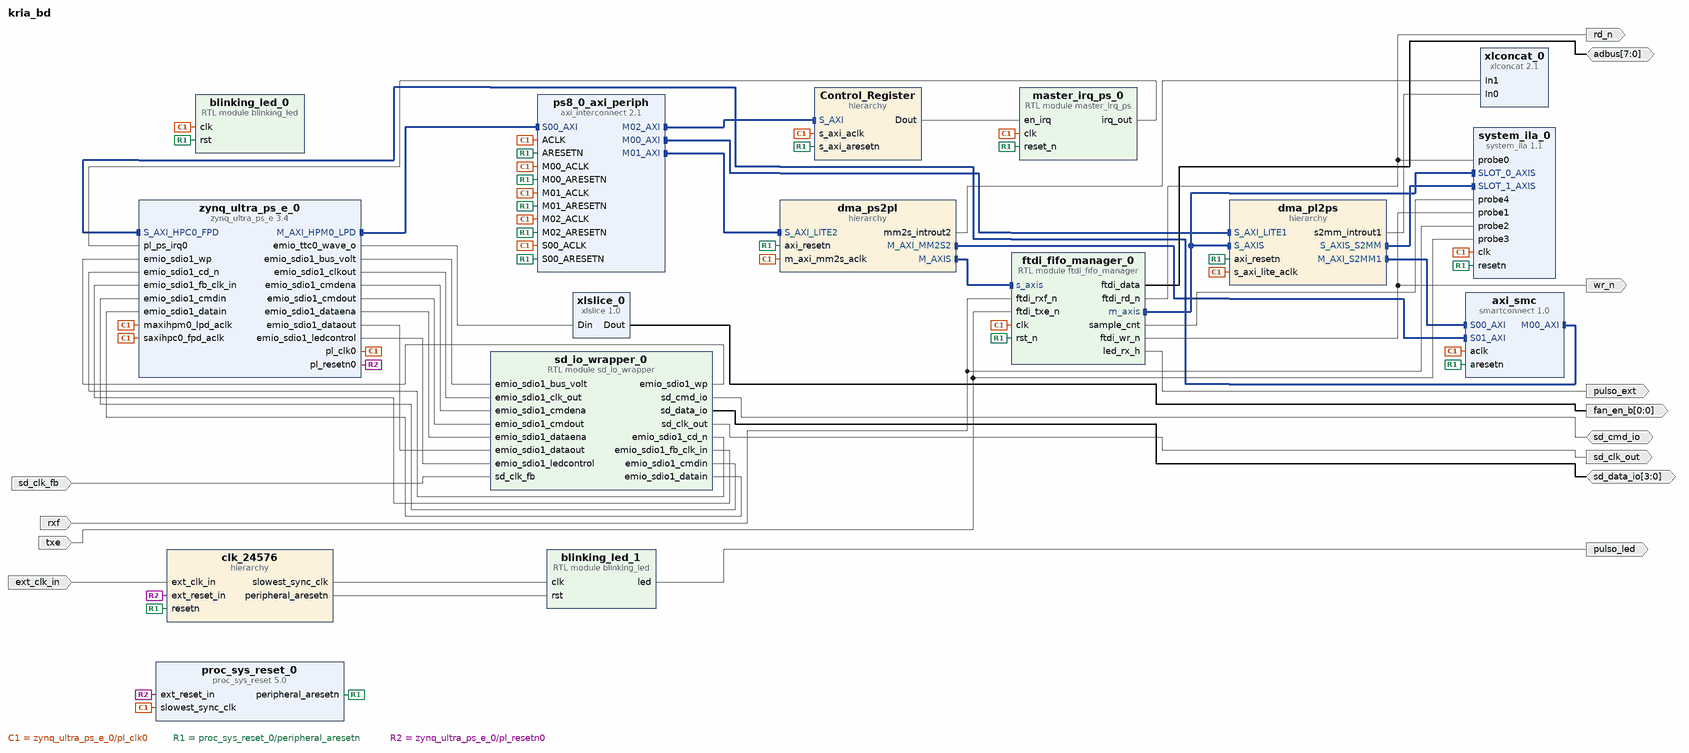
[diagram p0: block diagram of the top level]
# Vivado block design kria_bd, xck26-sfvc784-2LV-c, Vivado 2022.2
create_bd_design kria_bd

create_bd_port -dir O -from 0 -to 0 fan_en_b
create_bd_port -dir O pulso_led
create_bd_port -dir I -type clk ext_clk_in
set_property -dict {CONFIG.FREQ_HZ 24576000} [get_bd_ports ext_clk_in]
create_bd_port -dir O pulso_ext
create_bd_port -dir IO -from 7 -to 0 adbus
create_bd_port -dir O rd_n
create_bd_port -dir O wr_n
create_bd_port -dir I rxf
create_bd_port -dir I txe
create_bd_port -dir O sd_clk_out
create_bd_port -dir IO sd_cmd_io
create_bd_port -dir IO -from 3 -to 0 sd_data_io
create_bd_port -dir I sd_clk_fb

create_bd_cell -type ip -vlnv xilinx.com:ip:xlslice:1.0 xlslice_0
set_property -dict {CONFIG.DIN_FROM 2 CONFIG.DIN_TO 2 CONFIG.DIN_WIDTH 3} [get_bd_cells xlslice_0]
create_bd_cell -type ip -vlnv xilinx.com:ip:zynq_ultra_ps_e:3.4 zynq_ultra_ps_e_0
set_property -dict [list \
  CONFIG.PSU_BANK_0_IO_STANDARD LVCMOS18 \
  CONFIG.PSU_BANK_1_IO_STANDARD LVCMOS18 \
  CONFIG.PSU_BANK_2_IO_STANDARD LVCMOS18 \
  CONFIG.PSU_BANK_3_IO_STANDARD LVCMOS18 \
  CONFIG.PSU_USB3__DUAL_CLOCK_ENABLE 0 \
  CONFIG.PSU__CRF_APB__ACPU_CTRL__FREQMHZ 1333.333 \
  CONFIG.PSU__CRF_APB__ACPU_CTRL__SRCSEL APLL \
  CONFIG.PSU__CRF_APB__APLL_CTRL__SRCSEL PSS_REF_CLK \
  CONFIG.PSU__CRF_APB__APLL_FRAC_CFG__ENABLED 1 \
  CONFIG.PSU__CRF_APB__DBG_FPD_CTRL__FREQMHZ 250 \
  CONFIG.PSU__CRF_APB__DBG_FPD_CTRL__SRCSEL IOPLL \
  CONFIG.PSU__CRF_APB__DBG_TRACE_CTRL__FREQMHZ 250 \
  CONFIG.PSU__CRF_APB__DBG_TRACE_CTRL__SRCSEL IOPLL \
  CONFIG.PSU__CRF_APB__DBG_TSTMP_CTRL__FREQMHZ 250 \
  CONFIG.PSU__CRF_APB__DBG_TSTMP_CTRL__SRCSEL IOPLL \
  CONFIG.PSU__CRF_APB__DDR_CTRL__FREQMHZ 1200 \
  CONFIG.PSU__CRF_APB__DDR_CTRL__SRCSEL DPLL \
  CONFIG.PSU__CRF_APB__DPDMA_REF_CTRL__FREQMHZ 600 \
  CONFIG.PSU__CRF_APB__DPDMA_REF_CTRL__SRCSEL APLL \
  CONFIG.PSU__CRF_APB__DPLL_CTRL__SRCSEL PSS_REF_CLK \
  CONFIG.PSU__CRF_APB__DP_AUDIO_REF_CTRL__SRCSEL RPLL \
  CONFIG.PSU__CRF_APB__DP_STC_REF_CTRL__SRCSEL RPLL \
  CONFIG.PSU__CRF_APB__DP_VIDEO_REF_CTRL__SRCSEL VPLL \
  CONFIG.PSU__CRF_APB__GDMA_REF_CTRL__FREQMHZ 600 \
  CONFIG.PSU__CRF_APB__GDMA_REF_CTRL__SRCSEL DPLL \
  CONFIG.PSU__CRF_APB__GPU_REF_CTRL__FREQMHZ 600 \
  CONFIG.PSU__CRF_APB__GPU_REF_CTRL__SRCSEL IOPLL \
  CONFIG.PSU__CRF_APB__TOPSW_LSBUS_CTRL__FREQMHZ 100 \
  CONFIG.PSU__CRF_APB__TOPSW_LSBUS_CTRL__SRCSEL IOPLL \
  CONFIG.PSU__CRF_APB__TOPSW_MAIN_CTRL__FREQMHZ 533.33 \
  CONFIG.PSU__CRF_APB__TOPSW_MAIN_CTRL__SRCSEL DPLL \
  CONFIG.PSU__CRF_APB__VPLL_CTRL__SRCSEL PSS_REF_CLK \
  CONFIG.PSU__CRL_APB__ADMA_REF_CTRL__FREQMHZ 500 \
  CONFIG.PSU__CRL_APB__ADMA_REF_CTRL__SRCSEL IOPLL \
  CONFIG.PSU__CRL_APB__CPU_R5_CTRL__FREQMHZ 533.333 \
  CONFIG.PSU__CRL_APB__CPU_R5_CTRL__SRCSEL RPLL \
  CONFIG.PSU__CRL_APB__DBG_LPD_CTRL__FREQMHZ 250 \
  CONFIG.PSU__CRL_APB__DBG_LPD_CTRL__SRCSEL IOPLL \
  CONFIG.PSU__CRL_APB__IOPLL_CTRL__SRCSEL PSS_REF_CLK \
  CONFIG.PSU__CRL_APB__IOU_SWITCH_CTRL__FREQMHZ 250 \
  CONFIG.PSU__CRL_APB__IOU_SWITCH_CTRL__SRCSEL IOPLL \
  CONFIG.PSU__CRL_APB__LPD_LSBUS_CTRL__FREQMHZ 100 \
  CONFIG.PSU__CRL_APB__LPD_LSBUS_CTRL__SRCSEL IOPLL \
  CONFIG.PSU__CRL_APB__LPD_SWITCH_CTRL__FREQMHZ 500 \
  CONFIG.PSU__CRL_APB__LPD_SWITCH_CTRL__SRCSEL IOPLL \
  CONFIG.PSU__CRL_APB__PCAP_CTRL__FREQMHZ 200 \
  CONFIG.PSU__CRL_APB__PCAP_CTRL__SRCSEL IOPLL \
  CONFIG.PSU__CRL_APB__PL0_REF_CTRL__FREQMHZ 100 \
  CONFIG.PSU__CRL_APB__PL0_REF_CTRL__SRCSEL IOPLL \
  CONFIG.PSU__CRL_APB__QSPI_REF_CTRL__FREQMHZ 125 \
  CONFIG.PSU__CRL_APB__QSPI_REF_CTRL__SRCSEL IOPLL \
  CONFIG.PSU__CRL_APB__RPLL_CTRL__SRCSEL PSS_REF_CLK \
  CONFIG.PSU__CRL_APB__SDIO1_REF_CTRL__FREQMHZ 10 \
  CONFIG.PSU__CRL_APB__SDIO1_REF_CTRL__SRCSEL IOPLL \
  CONFIG.PSU__CRL_APB__SPI1_REF_CTRL__SRCSEL IOPLL \
  CONFIG.PSU__CRL_APB__TIMESTAMP_REF_CTRL__FREQMHZ 100 \
  CONFIG.PSU__CRL_APB__TIMESTAMP_REF_CTRL__SRCSEL IOPLL \
  CONFIG.PSU__CRL_APB__USB3__ENABLE 0 \
  CONFIG.PSU__CSUPMU__PERIPHERAL__VALID 1 \
  CONFIG.PSU__DDRC__BUS_WIDTH {64 Bit} \
  CONFIG.PSU__DDRC__COMPONENTS Components \
  CONFIG.PSU__DDRC__DEVICE_CAPACITY {8192 MBits} \
  CONFIG.PSU__DDRC__DRAM_WIDTH {16 Bits} \
  CONFIG.PSU__DDRC__ECC Disabled \
  CONFIG.PSU__DDRC__MEMORY_TYPE {DDR 4} \
  CONFIG.PSU__DDRC__SPEED_BIN DDR4_2400R \
  CONFIG.PSU__DDR_HIGH_ADDRESS_GUI_ENABLE 1 \
  CONFIG.PSU__DDR__INTERFACE__FREQMHZ 600.000 \
  CONFIG.PSU__DISPLAYPORT__PERIPHERAL__ENABLE 0 \
  CONFIG.PSU__DLL__ISUSED 1 \
  CONFIG.PSU__FPGA_PL0_ENABLE 1 \
  CONFIG.PSU__GPIO0_MIO__IO {MIO 0 .. 25} \
  CONFIG.PSU__GPIO0_MIO__PERIPHERAL__ENABLE 1 \
  CONFIG.PSU__GPIO1_MIO__IO {MIO 26 .. 51} \
  CONFIG.PSU__GPIO1_MIO__PERIPHERAL__ENABLE 1 \
  CONFIG.PSU__I2C1__PERIPHERAL__ENABLE 1 \
  CONFIG.PSU__I2C1__PERIPHERAL__IO {MIO 24 .. 25} \
  CONFIG.PSU__IOU_SLCR__IOU_TTC_APB_CLK__TTC0_SEL APB \
  CONFIG.PSU__IOU_SLCR__IOU_TTC_APB_CLK__TTC1_SEL APB \
  CONFIG.PSU__IOU_SLCR__IOU_TTC_APB_CLK__TTC2_SEL APB \
  CONFIG.PSU__IOU_SLCR__IOU_TTC_APB_CLK__TTC3_SEL APB \
  CONFIG.PSU__OVERRIDE__BASIC_CLOCK 0 \
  CONFIG.PSU__PMU_COHERENCY 0 \
  CONFIG.PSU__PMU__AIBACK__ENABLE 0 \
  CONFIG.PSU__PMU__EMIO_GPI__ENABLE 0 \
  CONFIG.PSU__PMU__EMIO_GPO__ENABLE 0 \
  CONFIG.PSU__PMU__GPI0__ENABLE 1 \
  CONFIG.PSU__PMU__GPI0__IO {MIO 26} \
  CONFIG.PSU__PMU__GPI1__ENABLE 0 \
  CONFIG.PSU__PMU__GPI2__ENABLE 0 \
  CONFIG.PSU__PMU__GPI3__ENABLE 0 \
  CONFIG.PSU__PMU__GPI4__ENABLE 0 \
  CONFIG.PSU__PMU__GPI5__ENABLE 1 \
  CONFIG.PSU__PMU__GPI5__IO {MIO 31} \
  CONFIG.PSU__PMU__GPO0__ENABLE 1 \
  CONFIG.PSU__PMU__GPO0__IO {MIO 32} \
  CONFIG.PSU__PMU__GPO1__ENABLE 1 \
  CONFIG.PSU__PMU__GPO1__IO {MIO 33} \
  CONFIG.PSU__PMU__GPO2__ENABLE 1 \
  CONFIG.PSU__PMU__GPO2__IO {MIO 34} \
  CONFIG.PSU__PMU__GPO2__POLARITY high \
  CONFIG.PSU__PMU__GPO3__ENABLE 1 \
  CONFIG.PSU__PMU__GPO3__IO {MIO 35} \
  CONFIG.PSU__PMU__GPO3__POLARITY low \
  CONFIG.PSU__PMU__GPO4__ENABLE 0 \
  CONFIG.PSU__PMU__GPO5__ENABLE 0 \
  CONFIG.PSU__PMU__PERIPHERAL__ENABLE 1 \
  CONFIG.PSU__PMU__PLERROR__ENABLE 0 \
  CONFIG.PSU__PRESET_APPLIED 1 \
  CONFIG.PSU__PSS_REF_CLK__FREQMHZ 33.333333333 \
  CONFIG.PSU__QSPI__PERIPHERAL__ENABLE 0 \
  CONFIG.PSU__SD0__CLK_100_SDR_OTAP_DLY 0x3 \
  CONFIG.PSU__SD0__CLK_200_SDR_OTAP_DLY 0x3 \
  CONFIG.PSU__SD0__CLK_50_DDR_ITAP_DLY 0x3D \
  CONFIG.PSU__SD0__CLK_50_DDR_OTAP_DLY 0x4 \
  CONFIG.PSU__SD0__CLK_50_SDR_ITAP_DLY 0x15 \
  CONFIG.PSU__SD0__CLK_50_SDR_OTAP_DLY 0x5 \
  CONFIG.PSU__SD1_COHERENCY 0 \
  CONFIG.PSU__SD1_ROUTE_THROUGH_FPD 0 \
  CONFIG.PSU__SD1__CLK_50_SDR_ITAP_DLY 0x15 \
  CONFIG.PSU__SD1__CLK_50_SDR_OTAP_DLY 0x5 \
  CONFIG.PSU__SD1__DATA_TRANSFER_MODE 4Bit \
  CONFIG.PSU__SD1__GRP_CD__ENABLE 1 \
  CONFIG.PSU__SD1__GRP_CD__IO EMIO \
  CONFIG.PSU__SD1__GRP_POW__ENABLE 0 \
  CONFIG.PSU__SD1__GRP_WP__ENABLE 1 \
  CONFIG.PSU__SD1__GRP_WP__IO EMIO \
  CONFIG.PSU__SD1__PERIPHERAL__ENABLE 1 \
  CONFIG.PSU__SD1__PERIPHERAL__IO EMIO \
  CONFIG.PSU__SD1__SLOT_TYPE {SD 2.0} \
  CONFIG.PSU__SPI1__GRP_SS0__IO {MIO 9} \
  CONFIG.PSU__SPI1__PERIPHERAL__ENABLE 1 \
  CONFIG.PSU__SPI1__PERIPHERAL__IO {MIO 6 .. 11} \
  CONFIG.PSU__SWDT0__CLOCK__ENABLE 0 \
  CONFIG.PSU__SWDT0__PERIPHERAL__ENABLE 1 \
  CONFIG.PSU__SWDT0__RESET__ENABLE 0 \
  CONFIG.PSU__SWDT1__CLOCK__ENABLE 0 \
  CONFIG.PSU__SWDT1__PERIPHERAL__ENABLE 1 \
  CONFIG.PSU__SWDT1__RESET__ENABLE 0 \
  CONFIG.PSU__TTC0__CLOCK__ENABLE 0 \
  CONFIG.PSU__TTC0__PERIPHERAL__ENABLE 1 \
  CONFIG.PSU__TTC0__WAVEOUT__ENABLE 1 \
  CONFIG.PSU__TTC0__WAVEOUT__IO EMIO \
  CONFIG.PSU__TTC1__CLOCK__ENABLE 0 \
  CONFIG.PSU__TTC1__PERIPHERAL__ENABLE 1 \
  CONFIG.PSU__TTC1__WAVEOUT__ENABLE 0 \
  CONFIG.PSU__TTC2__CLOCK__ENABLE 0 \
  CONFIG.PSU__TTC2__PERIPHERAL__ENABLE 1 \
  CONFIG.PSU__TTC2__WAVEOUT__ENABLE 0 \
  CONFIG.PSU__TTC3__CLOCK__ENABLE 0 \
  CONFIG.PSU__TTC3__PERIPHERAL__ENABLE 1 \
  CONFIG.PSU__TTC3__WAVEOUT__ENABLE 0 \
  CONFIG.PSU__UART1__BAUD_RATE 115200 \
  CONFIG.PSU__UART1__MODEM__ENABLE 0 \
  CONFIG.PSU__UART1__PERIPHERAL__ENABLE 1 \
  CONFIG.PSU__UART1__PERIPHERAL__IO {MIO 36 .. 37} \
  CONFIG.PSU__USB0__PERIPHERAL__ENABLE 0 \
  CONFIG.PSU__USB0__RESET__ENABLE 1 \
  CONFIG.PSU__USB0__RESET__IO {MIO 76} \
  CONFIG.PSU__USB1__RESET__ENABLE 1 \
  CONFIG.PSU__USB1__RESET__IO {MIO 77} \
  CONFIG.PSU__USE__IRQ0 1 \
  CONFIG.PSU__USE__M_AXI_GP0 0 \
  CONFIG.PSU__USE__M_AXI_GP1 0 \
  CONFIG.PSU__USE__M_AXI_GP2 1 \
  CONFIG.PSU__USE__S_AXI_GP0 1 \
] [get_bd_cells zynq_ultra_ps_e_0]
# 334 more settings of zynq_ultra_ps_e_0 are not shown: defaults, MIO pin electricals, DDR timing, and values the tool derives
create_bd_cell -type ip -vlnv xilinx.com:ip:proc_sys_reset:5.0 proc_sys_reset_0
create_bd_cell -type ip -vlnv xilinx.com:ip:axi_interconnect:2.1 ps8_0_axi_periph
set_property -dict {CONFIG.NUM_MI 3} [get_bd_cells ps8_0_axi_periph]
create_bd_cell -type ip -vlnv xilinx.com:ip:smartconnect:1.0 axi_smc
set_property -dict {CONFIG.NUM_SI 2} [get_bd_cells axi_smc]
create_bd_cell -type ip -vlnv xilinx.com:ip:xlconcat:2.1 xlconcat_0
set_property -dict {CONFIG.NUM_PORTS 2} [get_bd_cells xlconcat_0]
create_bd_cell -type hier dma_pl2ps
create_bd_cell -type module -reference blinking_led blinking_led_0
create_bd_cell -type hier Control_Register
create_bd_cell -type module -reference master_irq_ps master_irq_ps_0
create_bd_cell -type hier dma_ps2pl
create_bd_cell -type hier clk_24576
create_bd_cell -type module -reference blinking_led blinking_led_1
set_property -dict {CONFIG.BLINK_TIME 12288000 CONFIG.CLK_FREQ 24576000} [get_bd_cells blinking_led_1]
create_bd_cell -type ip -vlnv xilinx.com:ip:system_ila:1.1 system_ila_0
set_property -dict [list \
  CONFIG.C_DATA_DEPTH 16384 \
  CONFIG.C_MON_TYPE MIX \
  CONFIG.C_NUM_MONITOR_SLOTS 2 \
  CONFIG.C_NUM_OF_PROBES 5 \
  CONFIG.C_PROBE0_TYPE 0 \
  CONFIG.C_PROBE1_TYPE 0 \
  CONFIG.C_PROBE2_TYPE 0 \
  CONFIG.C_PROBE3_TYPE 0 \
  CONFIG.C_SLOT_0_APC_EN 0 \
  CONFIG.C_SLOT_0_AXI_DATA_SEL 1 \
  CONFIG.C_SLOT_0_AXI_TRIG_SEL 1 \
  CONFIG.C_SLOT_0_INTF_TYPE xilinx.com:interface:axis_rtl:1.0 \
  CONFIG.C_SLOT_1_APC_EN 0 \
  CONFIG.C_SLOT_1_AXI_AR_SEL_DATA 0 \
  CONFIG.C_SLOT_1_AXI_AR_SEL_TRIG 0 \
  CONFIG.C_SLOT_1_AXI_AW_SEL_DATA 1 \
  CONFIG.C_SLOT_1_AXI_AW_SEL_TRIG 1 \
  CONFIG.C_SLOT_1_AXI_B_SEL_DATA 1 \
  CONFIG.C_SLOT_1_AXI_B_SEL_TRIG 1 \
  CONFIG.C_SLOT_1_AXI_R_SEL_DATA 0 \
  CONFIG.C_SLOT_1_AXI_R_SEL_TRIG 0 \
  CONFIG.C_SLOT_1_AXI_W_SEL_DATA 1 \
  CONFIG.C_SLOT_1_AXI_W_SEL_TRIG 1 \
  CONFIG.C_SLOT_1_INTF_TYPE xilinx.com:interface:axis_rtl:1.0 \
  CONFIG.C_SLOT_1_TYPE 0 \
  CONFIG.C_SLOT_2_APC_EN 0 \
  CONFIG.C_SLOT_2_AXI_DATA_SEL 1 \
  CONFIG.C_SLOT_2_AXI_TRIG_SEL 1 \
  CONFIG.C_SLOT_2_INTF_TYPE xilinx.com:interface:axis_rtl:1.0 \
] [get_bd_cells system_ila_0]
create_bd_cell -type module -reference ftdi_fifo_manager ftdi_fifo_manager_0
create_bd_cell -type module -reference sd_io_wrapper sd_io_wrapper_0

# ---- hierarchy /dma_pl2ps ----
current_bd_instance /dma_pl2ps
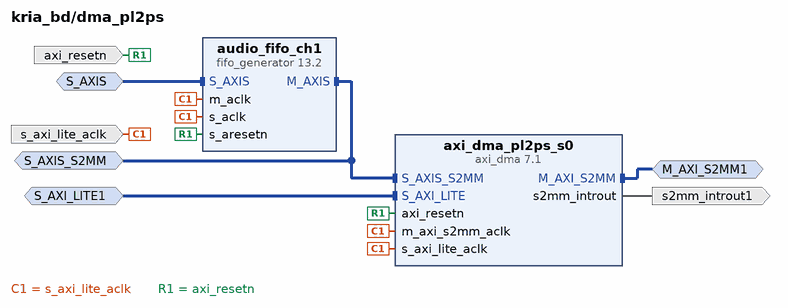
[diagram p1: block diagram inside /dma_pl2ps]
create_bd_intf_pin -mode Slave -vlnv xilinx.com:interface:aximm_rtl:1.0 S_AXI_LITE1
create_bd_intf_pin -mode Master -vlnv xilinx.com:interface:aximm_rtl:1.0 M_AXI_S2MM1
create_bd_intf_pin -mode Slave -vlnv xilinx.com:interface:axis_rtl:1.0 S_AXIS
create_bd_intf_pin -mode Monitor -vlnv xilinx.com:interface:axis_rtl:1.0 S_AXIS_S2MM
create_bd_pin -dir I -type clk s_axi_lite_aclk
create_bd_pin -dir I -type rst axi_resetn
create_bd_pin -dir O -type intr s2mm_introut1

create_bd_cell -type ip -vlnv xilinx.com:ip:axi_dma:7.1 axi_dma_pl2ps_s0
set_property -dict [list \
  CONFIG.c_include_mm2s 0 \
  CONFIG.c_include_s2mm_dre 1 \
  CONFIG.c_include_sg 0 \
  CONFIG.c_s2mm_burst_size 32 \
  CONFIG.c_sg_length_width 15 \
] [get_bd_cells axi_dma_pl2ps_s0]
create_bd_cell -type ip -vlnv xilinx.com:ip:fifo_generator:13.2 audio_fifo_ch1
set_property -dict [list \
  CONFIG.Clock_Type_AXI Independent_Clock \
  CONFIG.Enable_TLAST true \
  CONFIG.FIFO_Application_Type_axis Packet_FIFO \
  CONFIG.FIFO_Implementation_axis Independent_Clocks_Block_RAM \
  CONFIG.HAS_TKEEP true \
  CONFIG.INTERFACE_TYPE AXI_STREAM \
  CONFIG.Input_Depth_axis 16384 \
  CONFIG.TDATA_NUM_BYTES 4 \
  CONFIG.TUSER_WIDTH 0 \
] [get_bd_cells audio_fifo_ch1]

# ---- hierarchy /Control_Register ----
current_bd_instance /Control_Register
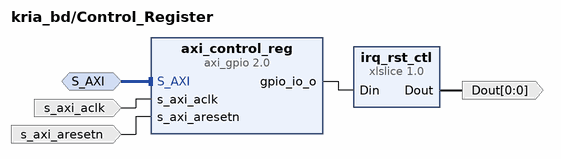
[diagram p2: block diagram inside /Control_Register]
create_bd_intf_pin -mode Slave -vlnv xilinx.com:interface:aximm_rtl:1.0 S_AXI
create_bd_pin -dir I -type clk s_axi_aclk
create_bd_pin -dir I -type rst s_axi_aresetn
create_bd_pin -dir O -from 0 -to 0 Dout

create_bd_cell -type ip -vlnv xilinx.com:ip:axi_gpio:2.0 axi_control_reg
set_property -dict {CONFIG.C_ALL_OUTPUTS 1} [get_bd_cells axi_control_reg]
create_bd_cell -type ip -vlnv xilinx.com:ip:xlslice:1.0 irq_rst_ctl

# ---- hierarchy /dma_ps2pl ----
current_bd_instance /dma_ps2pl
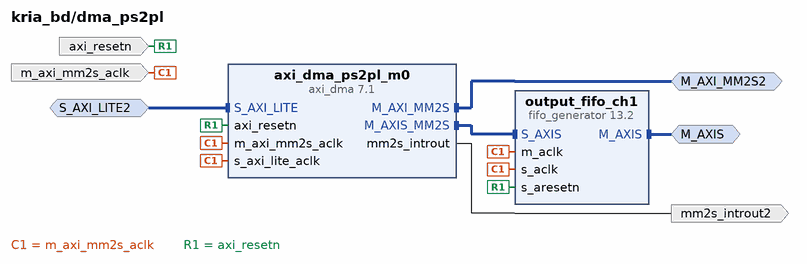
[diagram p3: block diagram inside /dma_ps2pl]
create_bd_intf_pin -mode Slave -vlnv xilinx.com:interface:aximm_rtl:1.0 S_AXI_LITE2
create_bd_intf_pin -mode Master -vlnv xilinx.com:interface:aximm_rtl:1.0 M_AXI_MM2S2
create_bd_intf_pin -mode Master -vlnv xilinx.com:interface:axis_rtl:1.0 M_AXIS
create_bd_pin -dir I -type clk m_axi_mm2s_aclk
create_bd_pin -dir I -type rst axi_resetn
create_bd_pin -dir O -type intr mm2s_introut2

create_bd_cell -type ip -vlnv xilinx.com:ip:axi_dma:7.1 axi_dma_ps2pl_m0
set_property -dict [list \
  CONFIG.c_include_mm2s_dre 1 \
  CONFIG.c_include_s2mm 0 \
  CONFIG.c_include_sg 0 \
  CONFIG.c_mm2s_burst_size 32 \
  CONFIG.c_sg_length_width 16 \
] [get_bd_cells axi_dma_ps2pl_m0]
create_bd_cell -type ip -vlnv xilinx.com:ip:fifo_generator:13.2 output_fifo_ch1
set_property -dict [list \
  CONFIG.Clock_Type_AXI Independent_Clock \
  CONFIG.Enable_TLAST true \
  CONFIG.FIFO_Application_Type_axis Packet_FIFO \
  CONFIG.FIFO_Implementation_axis Independent_Clocks_Block_RAM \
  CONFIG.HAS_TKEEP true \
  CONFIG.INTERFACE_TYPE AXI_STREAM \
  CONFIG.Input_Depth_axis 32768 \
  CONFIG.TDATA_NUM_BYTES 4 \
  CONFIG.TUSER_WIDTH 0 \
] [get_bd_cells output_fifo_ch1]

# ---- hierarchy /clk_24576 ----
current_bd_instance /clk_24576
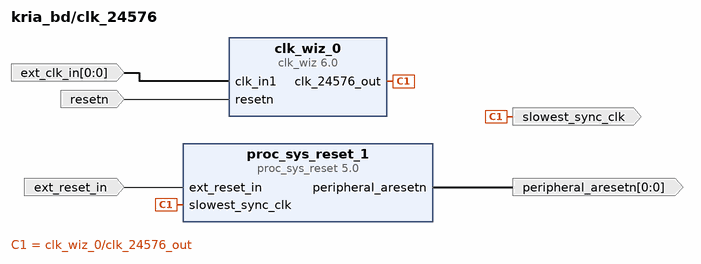
[diagram p4: block diagram inside /clk_24576]
create_bd_pin -dir I -from 0 -to 0 -type clk ext_clk_in
create_bd_pin -dir I -type rst resetn
create_bd_pin -dir O -type clk slowest_sync_clk
create_bd_pin -dir I -type rst ext_reset_in
create_bd_pin -dir O -from 0 -to 0 -type rst peripheral_aresetn

create_bd_cell -type ip -vlnv xilinx.com:ip:clk_wiz:6.0 clk_wiz_0
set_property -dict [list \
  CONFIG.CLKIN1_JITTER_PS 406.9 \
  CONFIG.CLKOUT1_JITTER 285.469 \
  CONFIG.CLKOUT1_PHASE_ERROR 232.556 \
  CONFIG.CLKOUT1_REQUESTED_OUT_FREQ 24.576 \
  CONFIG.CLK_OUT1_PORT clk_24576_out \
  CONFIG.MMCM_CLKFBOUT_MULT_F 45.000 \
  CONFIG.MMCM_CLKIN1_PERIOD 40.690 \
  CONFIG.MMCM_CLKIN2_PERIOD 10.0 \
  CONFIG.MMCM_CLKOUT0_DIVIDE_F 45.000 \
  CONFIG.PRIM_IN_FREQ 24.576 \
  CONFIG.PRIM_SOURCE Global_buffer \
  CONFIG.RESET_PORT resetn \
  CONFIG.RESET_TYPE ACTIVE_LOW \
  CONFIG.USE_LOCKED false \
] [get_bd_cells clk_wiz_0]
create_bd_cell -type ip -vlnv xilinx.com:ip:proc_sys_reset:5.0 proc_sys_reset_1

# ---- connections ----

current_bd_instance /dma_pl2ps
connect_bd_intf_net -intf_net Conn1 [get_bd_intf_pins S_AXIS] [get_bd_intf_pins audio_fifo_ch1/S_AXIS]
connect_bd_intf_net -intf_net audio_fifo_ch1_M_AXIS [get_bd_intf_pins axi_dma_pl2ps_s0/S_AXIS_S2MM] [get_bd_intf_pins audio_fifo_ch1/M_AXIS]
connect_bd_intf_net [get_bd_intf_pins axi_dma_pl2ps_s0/S_AXIS_S2MM] [get_bd_intf_pins S_AXIS_S2MM]
connect_bd_intf_net -intf_net axi_dma_pl2ps_ch0_M_AXI_S2MM [get_bd_intf_pins M_AXI_S2MM1] [get_bd_intf_pins axi_dma_pl2ps_s0/M_AXI_S2MM]
connect_bd_intf_net [get_bd_intf_pins S_AXI_LITE1] [get_bd_intf_pins axi_dma_pl2ps_s0/S_AXI_LITE]
connect_bd_net -net axi_dma_pl2ps_ch0_s2mm_introut [get_bd_pins axi_dma_pl2ps_s0/s2mm_introut] [get_bd_pins s2mm_introut1]
connect_bd_net -net clk_wiz_0_clk_out2 [get_bd_pins s_axi_lite_aclk] \
  [get_bd_pins axi_dma_pl2ps_s0/s_axi_lite_aclk] [get_bd_pins axi_dma_pl2ps_s0/m_axi_s2mm_aclk] \
  [get_bd_pins audio_fifo_ch1/s_aclk] [get_bd_pins audio_fifo_ch1/m_aclk]
connect_bd_net -net proc_sys_reset_0_peripheral_aresetn [get_bd_pins axi_resetn] \
  [get_bd_pins axi_dma_pl2ps_s0/axi_resetn] [get_bd_pins audio_fifo_ch1/s_aresetn]
set_property HDL_ATTRIBUTE.DEBUG true [get_bd_intf_nets Conn1]
set_property HDL_ATTRIBUTE.DEBUG true [get_bd_intf_nets audio_fifo_ch1_M_AXIS]
set_property HDL_ATTRIBUTE.MARK_DEBUG true [get_bd_intf_nets audio_fifo_ch1_M_AXIS]

current_bd_instance /Control_Register
connect_bd_intf_net [get_bd_intf_pins S_AXI] [get_bd_intf_pins axi_control_reg/S_AXI]
connect_bd_net [get_bd_pins axi_control_reg/gpio_io_o] [get_bd_pins irq_rst_ctl/Din]
connect_bd_net -net clk_wiz_0_clk_out2 [get_bd_pins s_axi_aclk] [get_bd_pins axi_control_reg/s_axi_aclk]
connect_bd_net [get_bd_pins irq_rst_ctl/Dout] [get_bd_pins Dout]
connect_bd_net -net proc_sys_reset_0_peripheral_aresetn [get_bd_pins s_axi_aresetn] [get_bd_pins axi_control_reg/s_axi_aresetn]

current_bd_instance /dma_ps2pl
connect_bd_intf_net [get_bd_intf_pins M_AXIS] [get_bd_intf_pins output_fifo_ch1/M_AXIS]
connect_bd_intf_net [get_bd_intf_pins axi_dma_ps2pl_m0/M_AXIS_MM2S] [get_bd_intf_pins output_fifo_ch1/S_AXIS]
connect_bd_intf_net [get_bd_intf_pins M_AXI_MM2S2] [get_bd_intf_pins axi_dma_ps2pl_m0/M_AXI_MM2S]
connect_bd_intf_net [get_bd_intf_pins S_AXI_LITE2] [get_bd_intf_pins axi_dma_ps2pl_m0/S_AXI_LITE]
connect_bd_net [get_bd_pins axi_dma_ps2pl_m0/mm2s_introut] [get_bd_pins mm2s_introut2]
connect_bd_net -net clk_wiz_0_clk_out2 [get_bd_pins m_axi_mm2s_aclk] \
  [get_bd_pins axi_dma_ps2pl_m0/m_axi_mm2s_aclk] [get_bd_pins axi_dma_ps2pl_m0/s_axi_lite_aclk] \
  [get_bd_pins output_fifo_ch1/s_aclk] [get_bd_pins output_fifo_ch1/m_aclk]
connect_bd_net -net proc_sys_reset_0_peripheral_aresetn [get_bd_pins axi_resetn] \
  [get_bd_pins axi_dma_ps2pl_m0/axi_resetn] [get_bd_pins output_fifo_ch1/s_aresetn]

current_bd_instance /clk_24576
connect_bd_net [get_bd_pins clk_wiz_0/clk_24576_out] [get_bd_pins slowest_sync_clk] [get_bd_pins proc_sys_reset_1/slowest_sync_clk]
connect_bd_net [get_bd_pins ext_clk_in] [get_bd_pins clk_wiz_0/clk_in1]
connect_bd_net -net proc_sys_reset_0_peripheral_aresetn [get_bd_pins resetn] [get_bd_pins clk_wiz_0/resetn]
connect_bd_net [get_bd_pins proc_sys_reset_1/peripheral_aresetn] [get_bd_pins peripheral_aresetn]
connect_bd_net -net zynq_ultra_ps_e_0_pl_resetn0 [get_bd_pins ext_reset_in] [get_bd_pins proc_sys_reset_1/ext_reset_in]

current_bd_instance /
connect_bd_intf_net -intf_net Conn [get_bd_intf_pins dma_pl2ps/S_AXIS_S2MM] [get_bd_intf_pins system_ila_0/SLOT_1_AXIS]
connect_bd_intf_net [get_bd_intf_pins Control_Register/S_AXI] [get_bd_intf_pins ps8_0_axi_periph/M02_AXI]
connect_bd_intf_net -intf_net axi_dma_pl2ps_ch0_M_AXI_S2MM [get_bd_intf_pins dma_pl2ps/M_AXI_S2MM1] [get_bd_intf_pins axi_smc/S00_AXI]
connect_bd_intf_net [get_bd_intf_pins axi_smc/M00_AXI] [get_bd_intf_pins zynq_ultra_ps_e_0/S_AXI_HPC0_FPD]
connect_bd_intf_net [get_bd_intf_pins ftdi_fifo_manager_0/s_axis] [get_bd_intf_pins dma_ps2pl/M_AXIS]
connect_bd_intf_net [get_bd_intf_pins dma_ps2pl/M_AXI_MM2S2] [get_bd_intf_pins axi_smc/S01_AXI]
connect_bd_intf_net -intf_net ftdi_fifo_manager_0_m_axis [get_bd_intf_pins ftdi_fifo_manager_0/m_axis] [get_bd_intf_pins dma_pl2ps/S_AXIS]
connect_bd_intf_net [get_bd_intf_pins ftdi_fifo_manager_0/m_axis] [get_bd_intf_pins system_ila_0/SLOT_0_AXIS]
connect_bd_intf_net [get_bd_intf_pins ps8_0_axi_periph/M00_AXI] [get_bd_intf_pins dma_pl2ps/S_AXI_LITE1]
connect_bd_intf_net [get_bd_intf_pins ps8_0_axi_periph/M01_AXI] [get_bd_intf_pins dma_ps2pl/S_AXI_LITE2]
connect_bd_intf_net [get_bd_intf_pins zynq_ultra_ps_e_0/M_AXI_HPM0_LPD] [get_bd_intf_pins ps8_0_axi_periph/S00_AXI]
connect_bd_net [get_bd_ports adbus] [get_bd_pins ftdi_fifo_manager_0/ftdi_data]
connect_bd_net [get_bd_ports sd_cmd_io] [get_bd_pins sd_io_wrapper_0/sd_cmd_io]
connect_bd_net [get_bd_ports sd_data_io] [get_bd_pins sd_io_wrapper_0/sd_data_io]
connect_bd_net -net axi_dma_pl2ps_ch0_s2mm_introut [get_bd_pins dma_pl2ps/s2mm_introut1] [get_bd_pins xlconcat_0/In0]
connect_bd_net [get_bd_pins blinking_led_1/led] [get_bd_ports pulso_led]
connect_bd_net -net clk_wiz_0_clk_24576_out [get_bd_pins clk_24576/slowest_sync_clk] [get_bd_pins blinking_led_1/clk]
connect_bd_net -net clk_wiz_0_clk_out2 [get_bd_pins zynq_ultra_ps_e_0/pl_clk0] \
  [get_bd_pins zynq_ultra_ps_e_0/maxihpm0_lpd_aclk] [get_bd_pins proc_sys_reset_0/slowest_sync_clk] \
  [get_bd_pins zynq_ultra_ps_e_0/saxihpc0_fpd_aclk] [get_bd_pins ps8_0_axi_periph/ACLK] \
  [get_bd_pins ps8_0_axi_periph/S00_ACLK] [get_bd_pins ps8_0_axi_periph/M00_ACLK] [get_bd_pins ps8_0_axi_periph/M01_ACLK] \
  [get_bd_pins axi_smc/aclk] [get_bd_pins dma_pl2ps/s_axi_lite_aclk] [get_bd_pins ps8_0_axi_periph/M02_ACLK] \
  [get_bd_pins blinking_led_0/clk] [get_bd_pins Control_Register/s_axi_aclk] [get_bd_pins master_irq_ps_0/clk] \
  [get_bd_pins dma_ps2pl/m_axi_mm2s_aclk] [get_bd_pins system_ila_0/clk] [get_bd_pins ftdi_fifo_manager_0/clk]
connect_bd_net [get_bd_pins dma_ps2pl/mm2s_introut2] [get_bd_pins xlconcat_0/In1]
connect_bd_net [get_bd_ports ext_clk_in] [get_bd_pins clk_24576/ext_clk_in]
connect_bd_net -net ftdi_fifo_manager_0_ftdi_rd_n [get_bd_pins ftdi_fifo_manager_0/ftdi_rd_n] [get_bd_ports rd_n] [get_bd_pins system_ila_0/probe0]
connect_bd_net -net ftdi_fifo_manager_0_ftdi_wr_n [get_bd_pins ftdi_fifo_manager_0/ftdi_wr_n] [get_bd_ports wr_n] [get_bd_pins system_ila_0/probe1]
connect_bd_net [get_bd_pins ftdi_fifo_manager_0/led_rx_h] [get_bd_ports pulso_ext]
connect_bd_net [get_bd_pins ftdi_fifo_manager_0/sample_cnt] [get_bd_pins system_ila_0/probe4]
connect_bd_net -net irq_rst_ctl_Dout [get_bd_pins Control_Register/Dout] [get_bd_pins master_irq_ps_0/en_irq]
connect_bd_net [get_bd_pins master_irq_ps_0/irq_out] [get_bd_pins zynq_ultra_ps_e_0/pl_ps_irq0]
connect_bd_net [get_bd_pins proc_sys_reset_0/peripheral_aresetn] \
  [get_bd_pins ps8_0_axi_periph/S00_ARESETN] [get_bd_pins ps8_0_axi_periph/M00_ARESETN] \
  [get_bd_pins ps8_0_axi_periph/ARESETN] [get_bd_pins ps8_0_axi_periph/M01_ARESETN] [get_bd_pins axi_smc/aresetn] \
  [get_bd_pins dma_pl2ps/axi_resetn] [get_bd_pins ps8_0_axi_periph/M02_ARESETN] [get_bd_pins blinking_led_0/rst] \
  [get_bd_pins Control_Register/s_axi_aresetn] [get_bd_pins master_irq_ps_0/reset_n] [get_bd_pins dma_ps2pl/axi_resetn] \
  [get_bd_pins clk_24576/resetn] [get_bd_pins system_ila_0/resetn] [get_bd_pins ftdi_fifo_manager_0/rst_n]
connect_bd_net -net proc_sys_reset_1_peripheral_aresetn [get_bd_pins clk_24576/peripheral_aresetn] [get_bd_pins blinking_led_1/rst]
connect_bd_net -net rxf_1 [get_bd_ports rxf] [get_bd_pins system_ila_0/probe2] [get_bd_pins ftdi_fifo_manager_0/ftdi_rxf_n]
connect_bd_net -net sd_clk_fb_0_1 [get_bd_ports sd_clk_fb] [get_bd_pins sd_io_wrapper_0/sd_clk_fb]
connect_bd_net [get_bd_pins sd_io_wrapper_0/emio_sdio1_wp] [get_bd_pins zynq_ultra_ps_e_0/emio_sdio1_wp]
connect_bd_net -net sd_io_wrapper_0_emio_sdio_1_cd_i [get_bd_pins sd_io_wrapper_0/emio_sdio1_cd_n] [get_bd_pins zynq_ultra_ps_e_0/emio_sdio1_cd_n]
connect_bd_net -net sd_io_wrapper_0_emio_sdio_1_clk_in_fb [get_bd_pins sd_io_wrapper_0/emio_sdio1_fb_clk_in] \
  [get_bd_pins zynq_ultra_ps_e_0/emio_sdio1_fb_clk_in]
connect_bd_net -net sd_io_wrapper_0_emio_sdio_1_cmd_i [get_bd_pins sd_io_wrapper_0/emio_sdio1_cmdin] [get_bd_pins zynq_ultra_ps_e_0/emio_sdio1_cmdin]
connect_bd_net -net sd_io_wrapper_0_emio_sdio_1_data_i [get_bd_pins sd_io_wrapper_0/emio_sdio1_datain] \
  [get_bd_pins zynq_ultra_ps_e_0/emio_sdio1_datain]
connect_bd_net [get_bd_pins sd_io_wrapper_0/sd_clk_out] [get_bd_ports sd_clk_out]
connect_bd_net -net txe_1 [get_bd_ports txe] [get_bd_pins system_ila_0/probe3] [get_bd_pins ftdi_fifo_manager_0/ftdi_txe_n]
connect_bd_net [get_bd_pins xlslice_0/Dout] [get_bd_ports fan_en_b]
connect_bd_net [get_bd_pins zynq_ultra_ps_e_0/emio_sdio1_bus_volt] [get_bd_pins sd_io_wrapper_0/emio_sdio1_bus_volt]
connect_bd_net [get_bd_pins zynq_ultra_ps_e_0/emio_sdio1_clkout] [get_bd_pins sd_io_wrapper_0/emio_sdio1_clk_out]
connect_bd_net [get_bd_pins zynq_ultra_ps_e_0/emio_sdio1_cmdena] [get_bd_pins sd_io_wrapper_0/emio_sdio1_cmdena]
connect_bd_net [get_bd_pins zynq_ultra_ps_e_0/emio_sdio1_cmdout] [get_bd_pins sd_io_wrapper_0/emio_sdio1_cmdout]
connect_bd_net [get_bd_pins zynq_ultra_ps_e_0/emio_sdio1_dataena] [get_bd_pins sd_io_wrapper_0/emio_sdio1_dataena]
connect_bd_net [get_bd_pins zynq_ultra_ps_e_0/emio_sdio1_dataout] [get_bd_pins sd_io_wrapper_0/emio_sdio1_dataout]
connect_bd_net [get_bd_pins zynq_ultra_ps_e_0/emio_sdio1_ledcontrol] [get_bd_pins sd_io_wrapper_0/emio_sdio1_ledcontrol]
connect_bd_net [get_bd_pins zynq_ultra_ps_e_0/emio_ttc0_wave_o] [get_bd_pins xlslice_0/Din]
connect_bd_net [get_bd_pins zynq_ultra_ps_e_0/pl_resetn0] [get_bd_pins proc_sys_reset_0/ext_reset_in] [get_bd_pins clk_24576/ext_reset_in]
set_property PFM.AXI_PORT {M_AXI_HPM0_FPD { memport "M_AXI_GP" sptag "" memory "" is_range "false" } M_AXI_HPM1_FPD { memport "M_AXI_GP" sptag "" memory "" is_range "false" } S_AXI_HP0_FPD { memport "S_AXI_HP" sptag "HP0" memory "" is_range "false" } S_AXI_HP1_FPD { memport "S_AXI_HP" sptag "HP1" memory "" is_range "false" } S_AXI_HP2_FPD { memport "S_AXI_HP" sptag "HP2" memory "" is_range "false" } S_AXI_HP3_FPD { memport "S_AXI_HP" sptag "HP3" memory "" is_range "false" } S_AXI_HPC1_FPD { memport "S_AXI_HPC" sptag "HPC1" memory "" is_range "false" } } [get_bd_cells zynq_ultra_ps_e_0]
set_property PFM.CLOCK {pl_clk0 {id "4" is_default "true" proc_sys_reset "/proc_sys_reset_0" status "fixed" freq_hz "99999992"}} [get_bd_cells zynq_ultra_ps_e_0]
set_property HDL_ATTRIBUTE.DEBUG true [get_bd_intf_nets Conn]
set_property HDL_ATTRIBUTE.DEBUG true [get_bd_intf_nets ftdi_fifo_manager_0_m_axis]
set_property HDL_ATTRIBUTE.MARK_DEBUG true [get_bd_intf_nets ftdi_fifo_manager_0_m_axis]
set_property HDL_ATTRIBUTE.DEBUG true [get_bd_nets ftdi_fifo_manager_0_ftdi_rd_n]
set_property HDL_ATTRIBUTE.MARK_DEBUG true [get_bd_nets ftdi_fifo_manager_0_ftdi_rd_n]
set_property HDL_ATTRIBUTE.DEBUG true [get_bd_nets ftdi_fifo_manager_0_ftdi_wr_n]
set_property HDL_ATTRIBUTE.MARK_DEBUG true [get_bd_nets ftdi_fifo_manager_0_ftdi_wr_n]
set_property HDL_ATTRIBUTE.DEBUG true [get_bd_nets rxf_1]
set_property HDL_ATTRIBUTE.MARK_DEBUG true [get_bd_nets rxf_1]
set_property HDL_ATTRIBUTE.DEBUG true [get_bd_nets txe_1]
set_property HDL_ATTRIBUTE.MARK_DEBUG true [get_bd_nets txe_1]

# ---- address map ----
assign_bd_address -offset 0x00000000 -range 2G -target_address_space [get_bd_addr_spaces dma_pl2ps/axi_dma_pl2ps_s0/Data_S2MM] [get_bd_addr_segs zynq_ultra_ps_e_0/SAXIGP0/HPC0_DDR_LOW]
exclude_bd_addr_seg -offset 0x00000000 -range 1 -target_address_space [get_bd_addr_spaces dma_pl2ps/axi_dma_pl2ps_s0/Data_S2MM] [get_bd_addr_segs zynq_ultra_ps_e_0/SAXIGP0/HPC0_DDR_HIGH]
exclude_bd_addr_seg -offset 0xFF000000 -range 16M -target_address_space [get_bd_addr_spaces dma_pl2ps/axi_dma_pl2ps_s0/Data_S2MM] [get_bd_addr_segs zynq_ultra_ps_e_0/SAXIGP0/HPC0_LPS_OCM]
assign_bd_address -offset 0x00000000 -range 2G -target_address_space [get_bd_addr_spaces dma_ps2pl/axi_dma_ps2pl_m0/Data_MM2S] [get_bd_addr_segs zynq_ultra_ps_e_0/SAXIGP0/HPC0_DDR_LOW]
exclude_bd_addr_seg -offset 0x00000000 -range 1 -target_address_space [get_bd_addr_spaces dma_ps2pl/axi_dma_ps2pl_m0/Data_MM2S] [get_bd_addr_segs zynq_ultra_ps_e_0/SAXIGP0/HPC0_DDR_HIGH]
exclude_bd_addr_seg -offset 0xFF000000 -range 16M -target_address_space [get_bd_addr_spaces dma_ps2pl/axi_dma_ps2pl_m0/Data_MM2S] [get_bd_addr_segs zynq_ultra_ps_e_0/SAXIGP0/HPC0_LPS_OCM]
assign_bd_address -offset 0x0080000000 -range 64K -target_address_space [get_bd_addr_spaces zynq_ultra_ps_e_0/Data] [get_bd_addr_segs Control_Register/axi_control_reg/S_AXI/Reg]
assign_bd_address -offset 0x0080010000 -range 64K -target_address_space [get_bd_addr_spaces zynq_ultra_ps_e_0/Data] [get_bd_addr_segs dma_pl2ps/axi_dma_pl2ps_s0/S_AXI_LITE/Reg]
assign_bd_address -offset 0x0080020000 -range 64K -target_address_space [get_bd_addr_spaces zynq_ultra_ps_e_0/Data] [get_bd_addr_segs dma_ps2pl/axi_dma_ps2pl_m0/S_AXI_LITE/Reg]

validate_bd_design
save_bd_design
